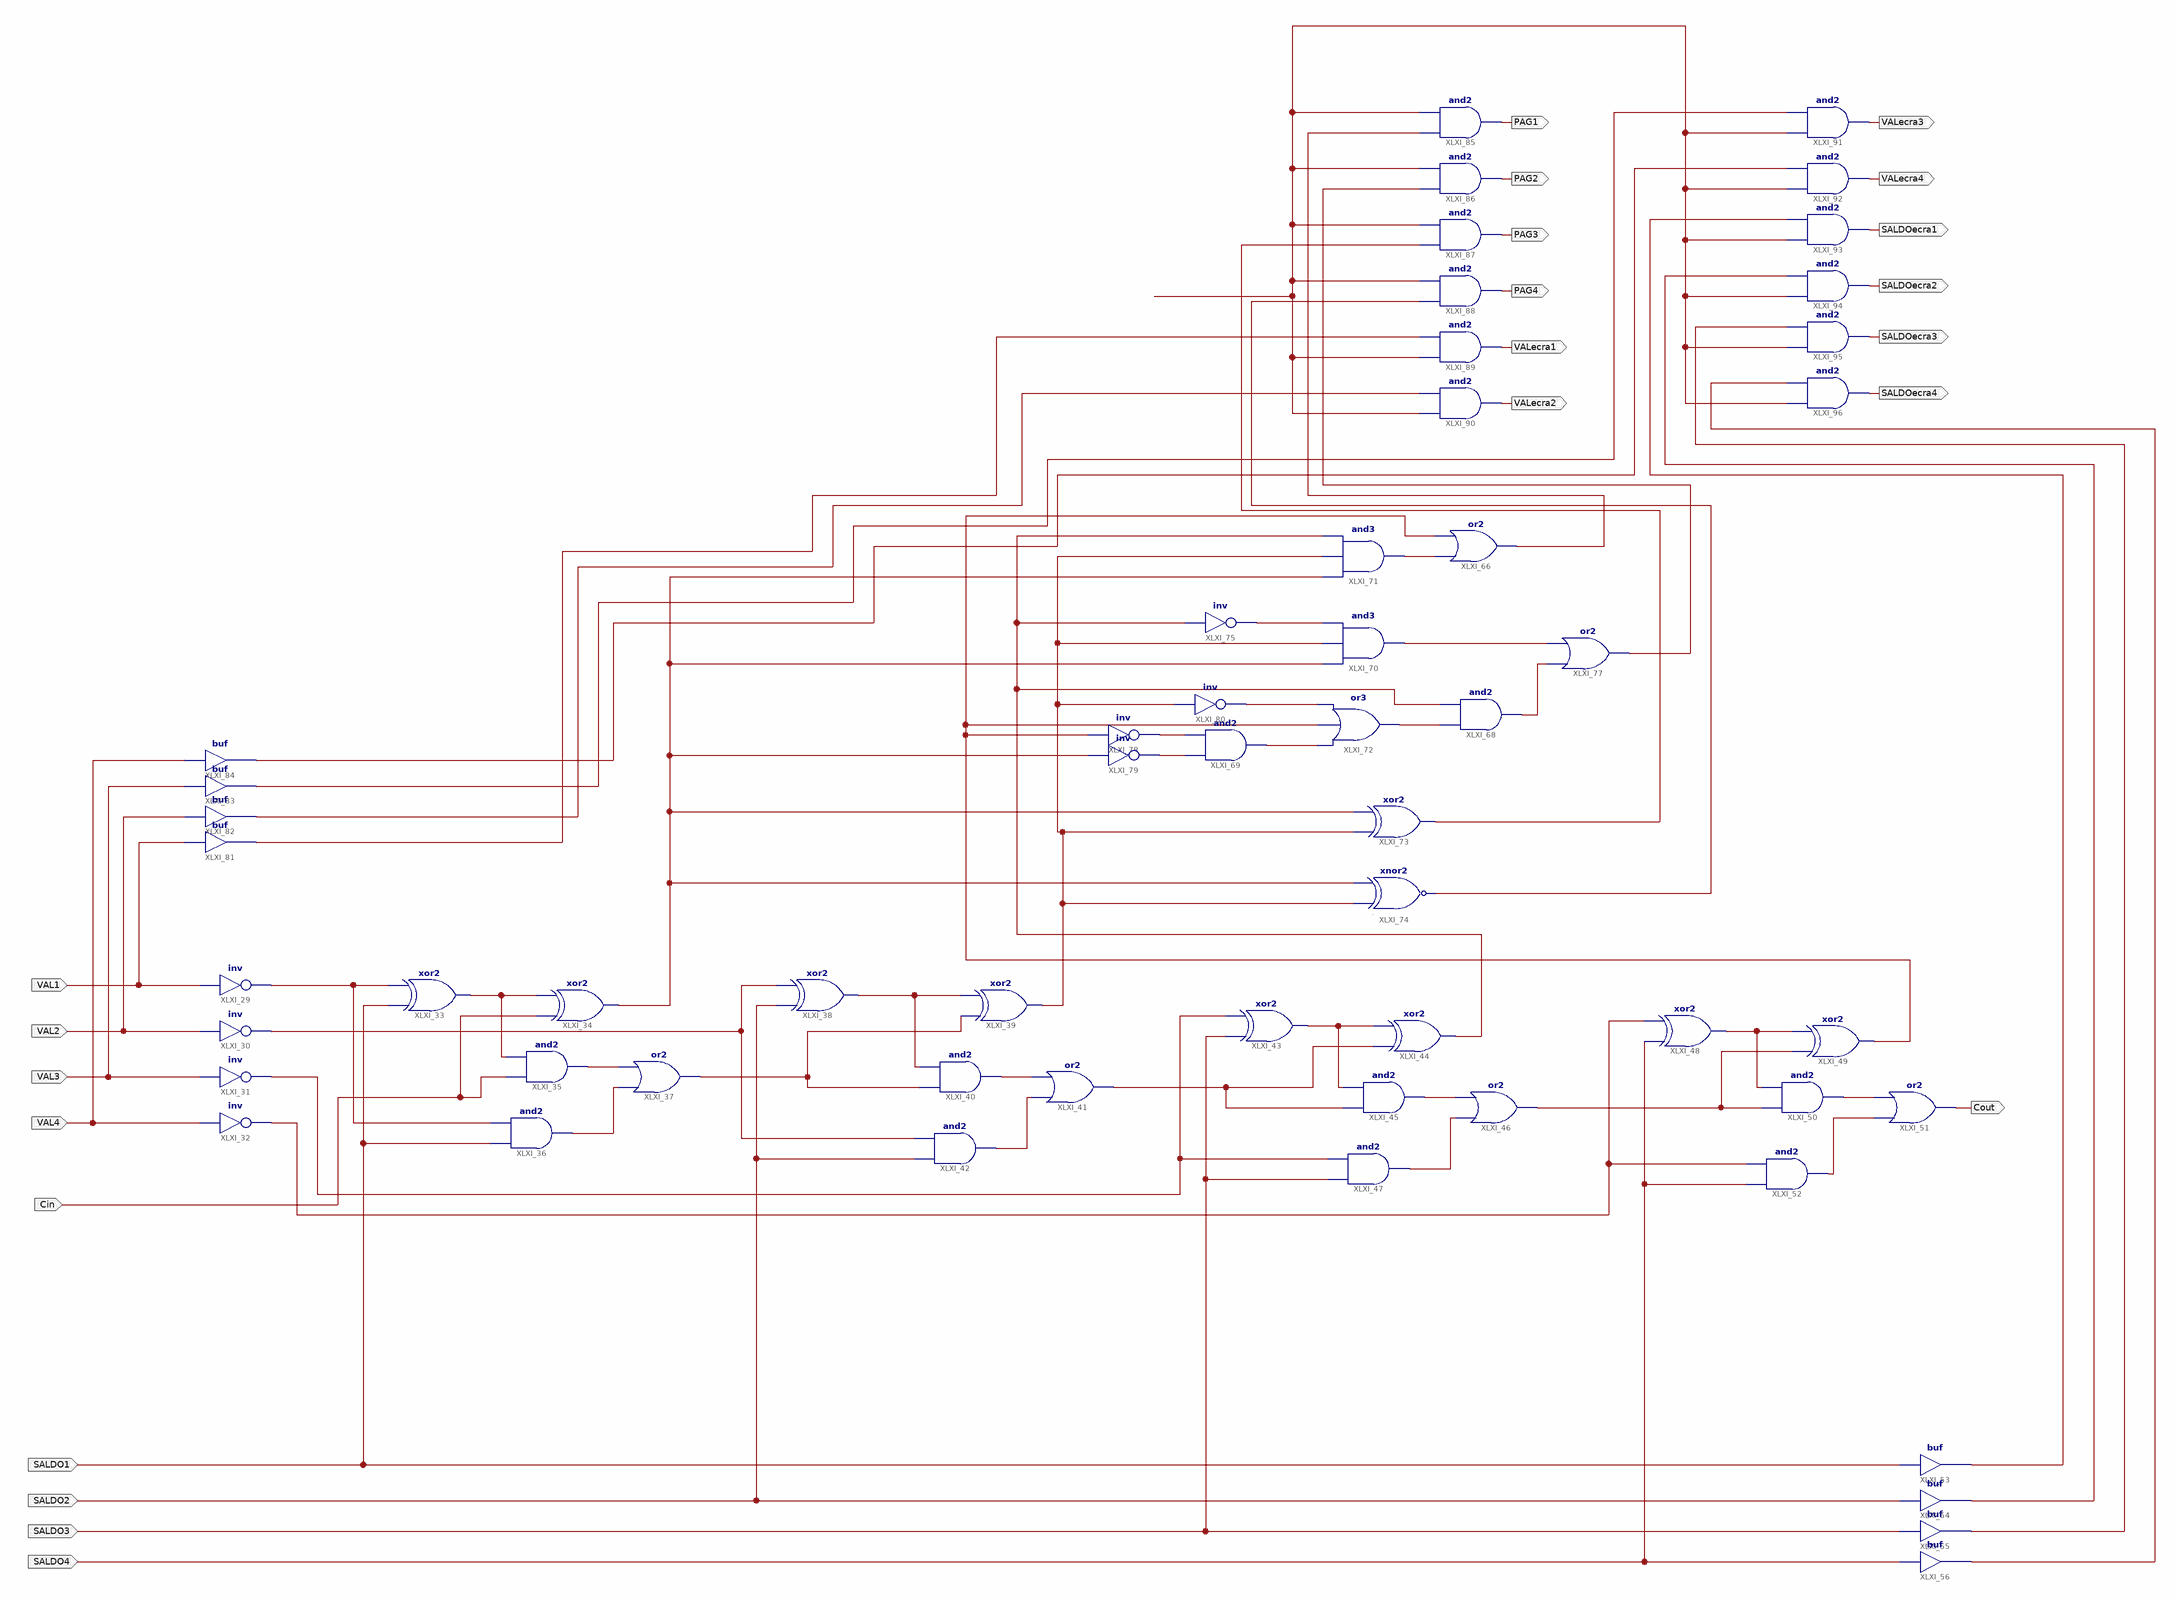
[diagram p0: schematic sheet 1]
// Xilinx ISE schematic shcematiproject.sch (spartan3e) as structural Verilog: 57 symbols, 22 ports
module shcematiproject (
  input  VAL1,
  input  VAL2,
  input  VAL3,
  input  VAL4,
  input  Cin,
  input  SALDO1,
  input  SALDO4,
  input  SALDO2,
  input  SALDO3,
  output Cout,
  output SALDOecra4,
  output SALDOecra3,
  output SALDOecra2,
  output SALDOecra1,
  output VALecra1,
  output VALecra2,
  output VALecra3,
  output VALecra4,
  output PAG1,
  output PAG2,
  output PAG3,
  output PAG4
);

  wire EXTCOMP, Saldoe1, Saldoe2, Saldoe3, Saldoe4, SOMA1, SOMA2, SOMA3, SOMA4, SOMAE1, SOMAE2, SOMAE3,
       SOMAE4, XLXN_53, XLXN_54, XLXN_55, XLXN_77, XLXN_78, XLXN_80, XLXN_81, XLXN_82, XLXN_84, XLXN_85,
       XLXN_86, XLXN_88, XLXN_90, XLXN_93, XLXN_99, XLXN_121, XLXN_124, XLXN_128, XLXN_129, XLXN_143,
       XLXN_151, XLXN_152, XLXN_153, XLXN_155, XLXN_156, XLXN_157, XLXN_158, XLXN_159, XLXN_175, XLXN_177,
       XLXN_181, XLXN_182;

  not XLXI_29 (XLXN_129, VAL1);
  not XLXI_30 (XLXN_121, VAL2);
  not XLXI_31 (XLXN_128, VAL3);
  not XLXI_32 (XLXN_124, VAL4);
  xor XLXI_33 (XLXN_55, SALDO1, XLXN_129);
  xor XLXI_34 (SOMA4, Cin, XLXN_55);
  and XLXI_35 (XLXN_53, Cin, XLXN_55);
  and XLXI_36 (XLXN_54, SALDO1, XLXN_129);
  or XLXI_37 (XLXN_90, XLXN_54, XLXN_53);
  xor XLXI_38 (XLXN_78, SALDO2, XLXN_121);
  xor XLXI_39 (SOMA3, XLXN_90, XLXN_78);
  and XLXI_40 (XLXN_77, XLXN_90, XLXN_78);
  or XLXI_41 (XLXN_93, XLXN_80, XLXN_77);
  and XLXI_42 (XLXN_80, SALDO2, XLXN_121);
  xor XLXI_43 (XLXN_82, SALDO3, XLXN_128);
  xor XLXI_44 (SOMA2, XLXN_93, XLXN_82);
  and XLXI_45 (XLXN_81, XLXN_93, XLXN_82);
  or XLXI_46 (XLXN_99, XLXN_84, XLXN_81);
  and XLXI_47 (XLXN_84, SALDO3, XLXN_128);
  xor XLXI_48 (XLXN_86, SALDO4, XLXN_124);
  xor XLXI_49 (SOMA1, XLXN_99, XLXN_86);
  and XLXI_50 (XLXN_85, XLXN_99, XLXN_86);
  or XLXI_51 (Cout, XLXN_88, XLXN_85);
  and XLXI_52 (XLXN_88, SALDO4, XLXN_124);
  buf XLXI_53 (Saldoe1, SALDO1);
  buf XLXI_54 (Saldoe2, SALDO2);
  buf XLXI_55 (Saldoe3, SALDO3);
  buf XLXI_56 (Saldoe4, SALDO4);
  or XLXI_66 (SOMAE1, XLXN_143, SOMA1);
  and XLXI_68 (XLXN_156, XLXN_153, SOMA2);
  and XLXI_69 (XLXN_155, XLXN_158, XLXN_157);
  and XLXI_70 (XLXN_152, SOMA4, SOMA3, XLXN_151);
  and XLXI_71 (XLXN_143, SOMA4, SOMA3, SOMA2);
  or XLXI_72 (XLXN_153, XLXN_155, SOMA1, XLXN_159);
  xor XLXI_73 (SOMAE3, SOMA3, SOMA4);
  xnor XLXI_74 (SOMAE4, SOMA3, SOMA4);
  not XLXI_75 (XLXN_151, SOMA2);
  or XLXI_77 (SOMAE2, XLXN_156, XLXN_152);
  not XLXI_78 (XLXN_157, SOMA1);
  not XLXI_79 (XLXN_158, SOMA4);
  not XLXI_80 (XLXN_159, SOMA3);
  buf XLXI_81 (XLXN_175, VAL1);
  buf XLXI_82 (XLXN_177, VAL2);
  buf XLXI_83 (XLXN_181, VAL3);
  buf XLXI_84 (XLXN_182, VAL4);
  and XLXI_85 (PAG1, SOMAE1, EXTCOMP);
  and XLXI_86 (PAG2, SOMAE2, EXTCOMP);
  and XLXI_87 (PAG3, SOMAE3, EXTCOMP);
  and XLXI_88 (PAG4, SOMAE4, EXTCOMP);
  and XLXI_89 (VALecra1, EXTCOMP, XLXN_175);
  and XLXI_90 (VALecra2, EXTCOMP, XLXN_177);
  and XLXI_91 (VALecra3, EXTCOMP, XLXN_181);
  and XLXI_92 (VALecra4, EXTCOMP, XLXN_182);
  and XLXI_93 (SALDOecra1, EXTCOMP, Saldoe1);
  and XLXI_94 (SALDOecra2, EXTCOMP, Saldoe2);
  and XLXI_95 (SALDOecra3, EXTCOMP, Saldoe3);
  and XLXI_96 (SALDOecra4, EXTCOMP, Saldoe4);
endmodule
